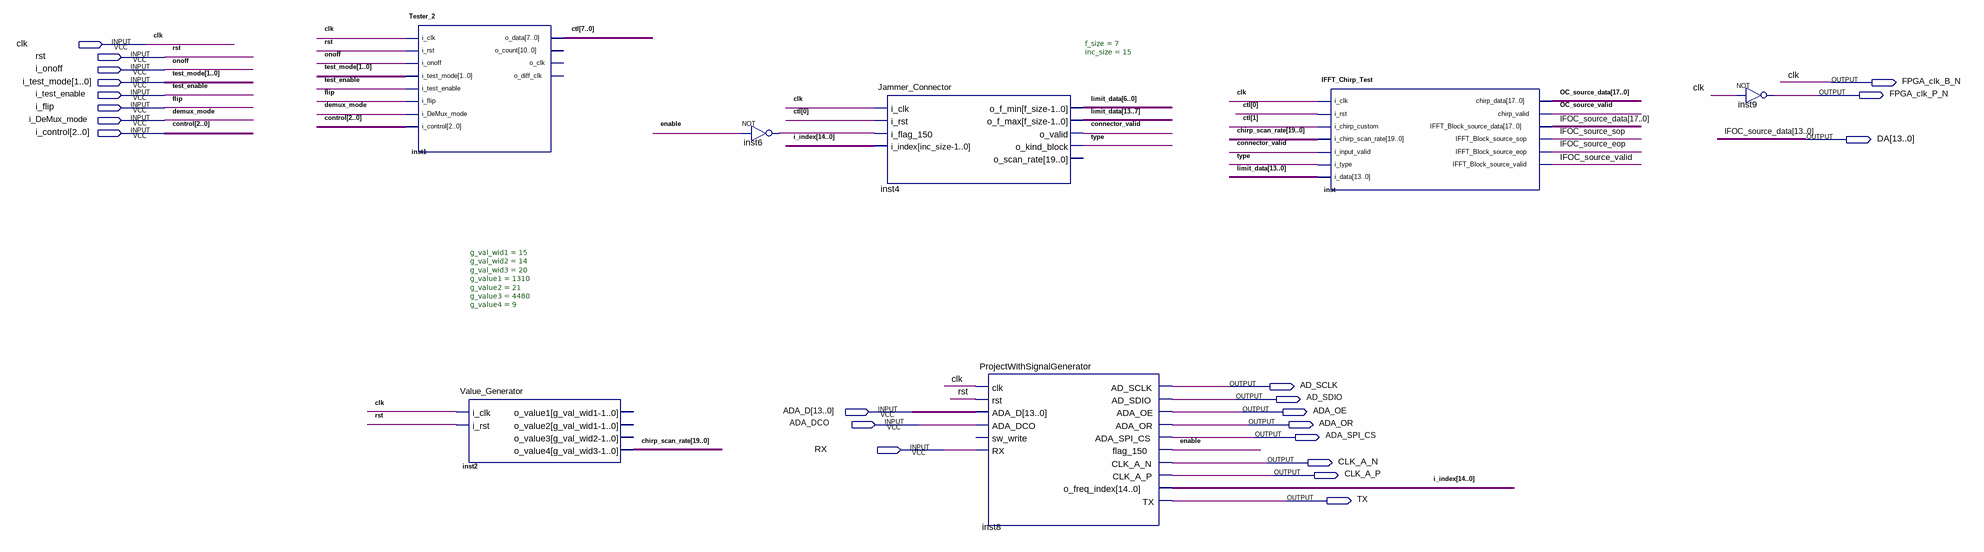
[diagram p0: schematic sheet]
// Quartus schematic IFFT_Chirp_ExTest2.bdf as structural Verilog: 7 symbols, 22 pins
module IFFT_Chirp_ExTest2 (
  input  clk,
  input  rst,
  input  i_onoff,
  input  [1:0] i_test_mode,
  input  i_test_enable,
  input  i_flip,
  input  i_DeMux_mode,
  input  [2:0] i_control,
  input  [13:0] ADA_D,
  input  ADA_DCO,
  input  RX,
  output FPGA_clk_B_N,
  output FPGA_clk_P_N,
  output [13:0] DA,
  output AD_SCLK,
  output AD_SDIO,
  output ADA_OE,
  output ADA_OR,
  output ADA_SPI_CS,
  output CLK_A_N,
  output CLK_A_P,
  output TX
);

  wire connector_valid, enable, IFOC_source_eop, IFOC_source_sop, IFOC_source_valid, inst6_out,
       OC_source_valid, \type ;
  wire [7:0] ctl;
  wire [13:0] limit_data;
  wire [14:0] i_index;
  wire [17:0] OC_source_data;
  wire [17:14] IFOC_source_data;
  wire [19:0] chirp_scan_rate;

  Tester_2 inst1 (
    .i_clk(clk), .i_rst(rst), .i_onoff(i_onoff), .i_test_mode(i_test_mode), .i_test_enable(i_test_enable),
    .i_flip(i_flip), .i_DeMux_mode(i_DeMux_mode), .i_control(i_control), .o_data(ctl));  // open: o_count, o_clk, o_diff_clk
  Value_Generator #(.g_val_wid1(15), .g_val_wid2(14), .g_val_wid3(20), .g_value1(1310), .g_value2(21), .g_value3(4480), .g_value4(9)) inst2 (
    .i_clk(clk), .i_rst(rst), .o_value4(chirp_scan_rate));  // open: o_value1, o_value2, o_value3
  not inst6 (inst6_out, enable);
  Jammer_Connector #(.f_size(7), .inc_size(15)) inst4 (
    .i_clk(clk), .i_rst(ctl[0]), .i_flag_150(inst6_out), .i_index(i_index), .o_f_min(limit_data[6:0]),
    .o_f_max(limit_data[13:7]), .o_valid(connector_valid), .o_kind_block(\type ));  // open: o_scan_rate
  ProjectWithSignalGenerator inst8 (
    .clk(clk), .rst(rst), .ADA_D(ADA_D), .ADA_DCO(ADA_DCO), .RX(RX), .AD_SCLK(AD_SCLK), .AD_SDIO(AD_SDIO),
    .ADA_OE(ADA_OE), .ADA_OR(ADA_OR), .ADA_SPI_CS(ADA_SPI_CS), .flag_150(enable), .CLK_A_N(CLK_A_N),
    .CLK_A_P(CLK_A_P), .o_freq_index(i_index), .TX(TX));  // open: sw_write
  IFFT_Chirp_Test inst (
    .i_clk(clk), .i_rst(ctl[0]), .i_chirp_custom(ctl[1]), .i_chirp_scan_rate(chirp_scan_rate),
    .i_input_valid(connector_valid), .i_type(\type ), .i_data(limit_data), .chirp_data(OC_source_data),
    .chirp_valid(OC_source_valid), .IFFT_Block_source_data({IFOC_source_data, DA}),
    .IFFT_Block_source_sop(IFOC_source_sop), .IFFT_Block_source_eop(IFOC_source_eop),
    .IFFT_Block_source_valid(IFOC_source_valid));
  not inst9 (FPGA_clk_P_N, clk);

  assign FPGA_clk_B_N = clk;

  // Other names for the same wires on the sheet: control[2:0] = i_control; demux_mode = i_DeMux_mode; flip = i_flip;
  //   IFOC_source_data[13:0] = DA; onoff = i_onoff; test_enable = i_test_enable; test_mode[1:0] = i_test_mode
endmodule
